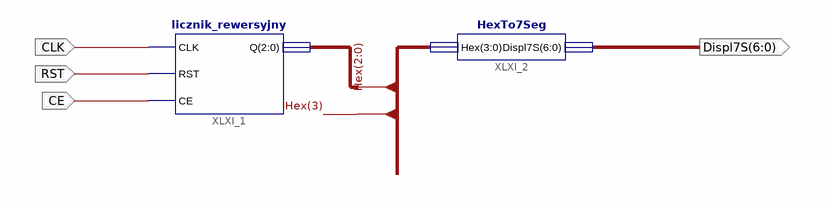
[diagram p0: schematic sheet 1]
// Xilinx ISE schematic licznik_na_ekran.sch (xc9500xl) as structural Verilog: 2 symbols, 4 ports
module licznik_na_ekran (
  input  CLK,
  input  RST,
  input  CE,
  output [6:0] Displ7S
);

  wire [3:0] Hex;

  licznik_rewersyjny XLXI_1 (.CLK(CLK), .RST(RST), .CE(CE), .Q(Hex[2:0]));
  HexTo7Seg XLXI_2 (.Hex(Hex), .Displ7S(Displ7S));
endmodule
